# Altium schematic sheet DXP格式 单片机交通灯.SchDoc
size A3
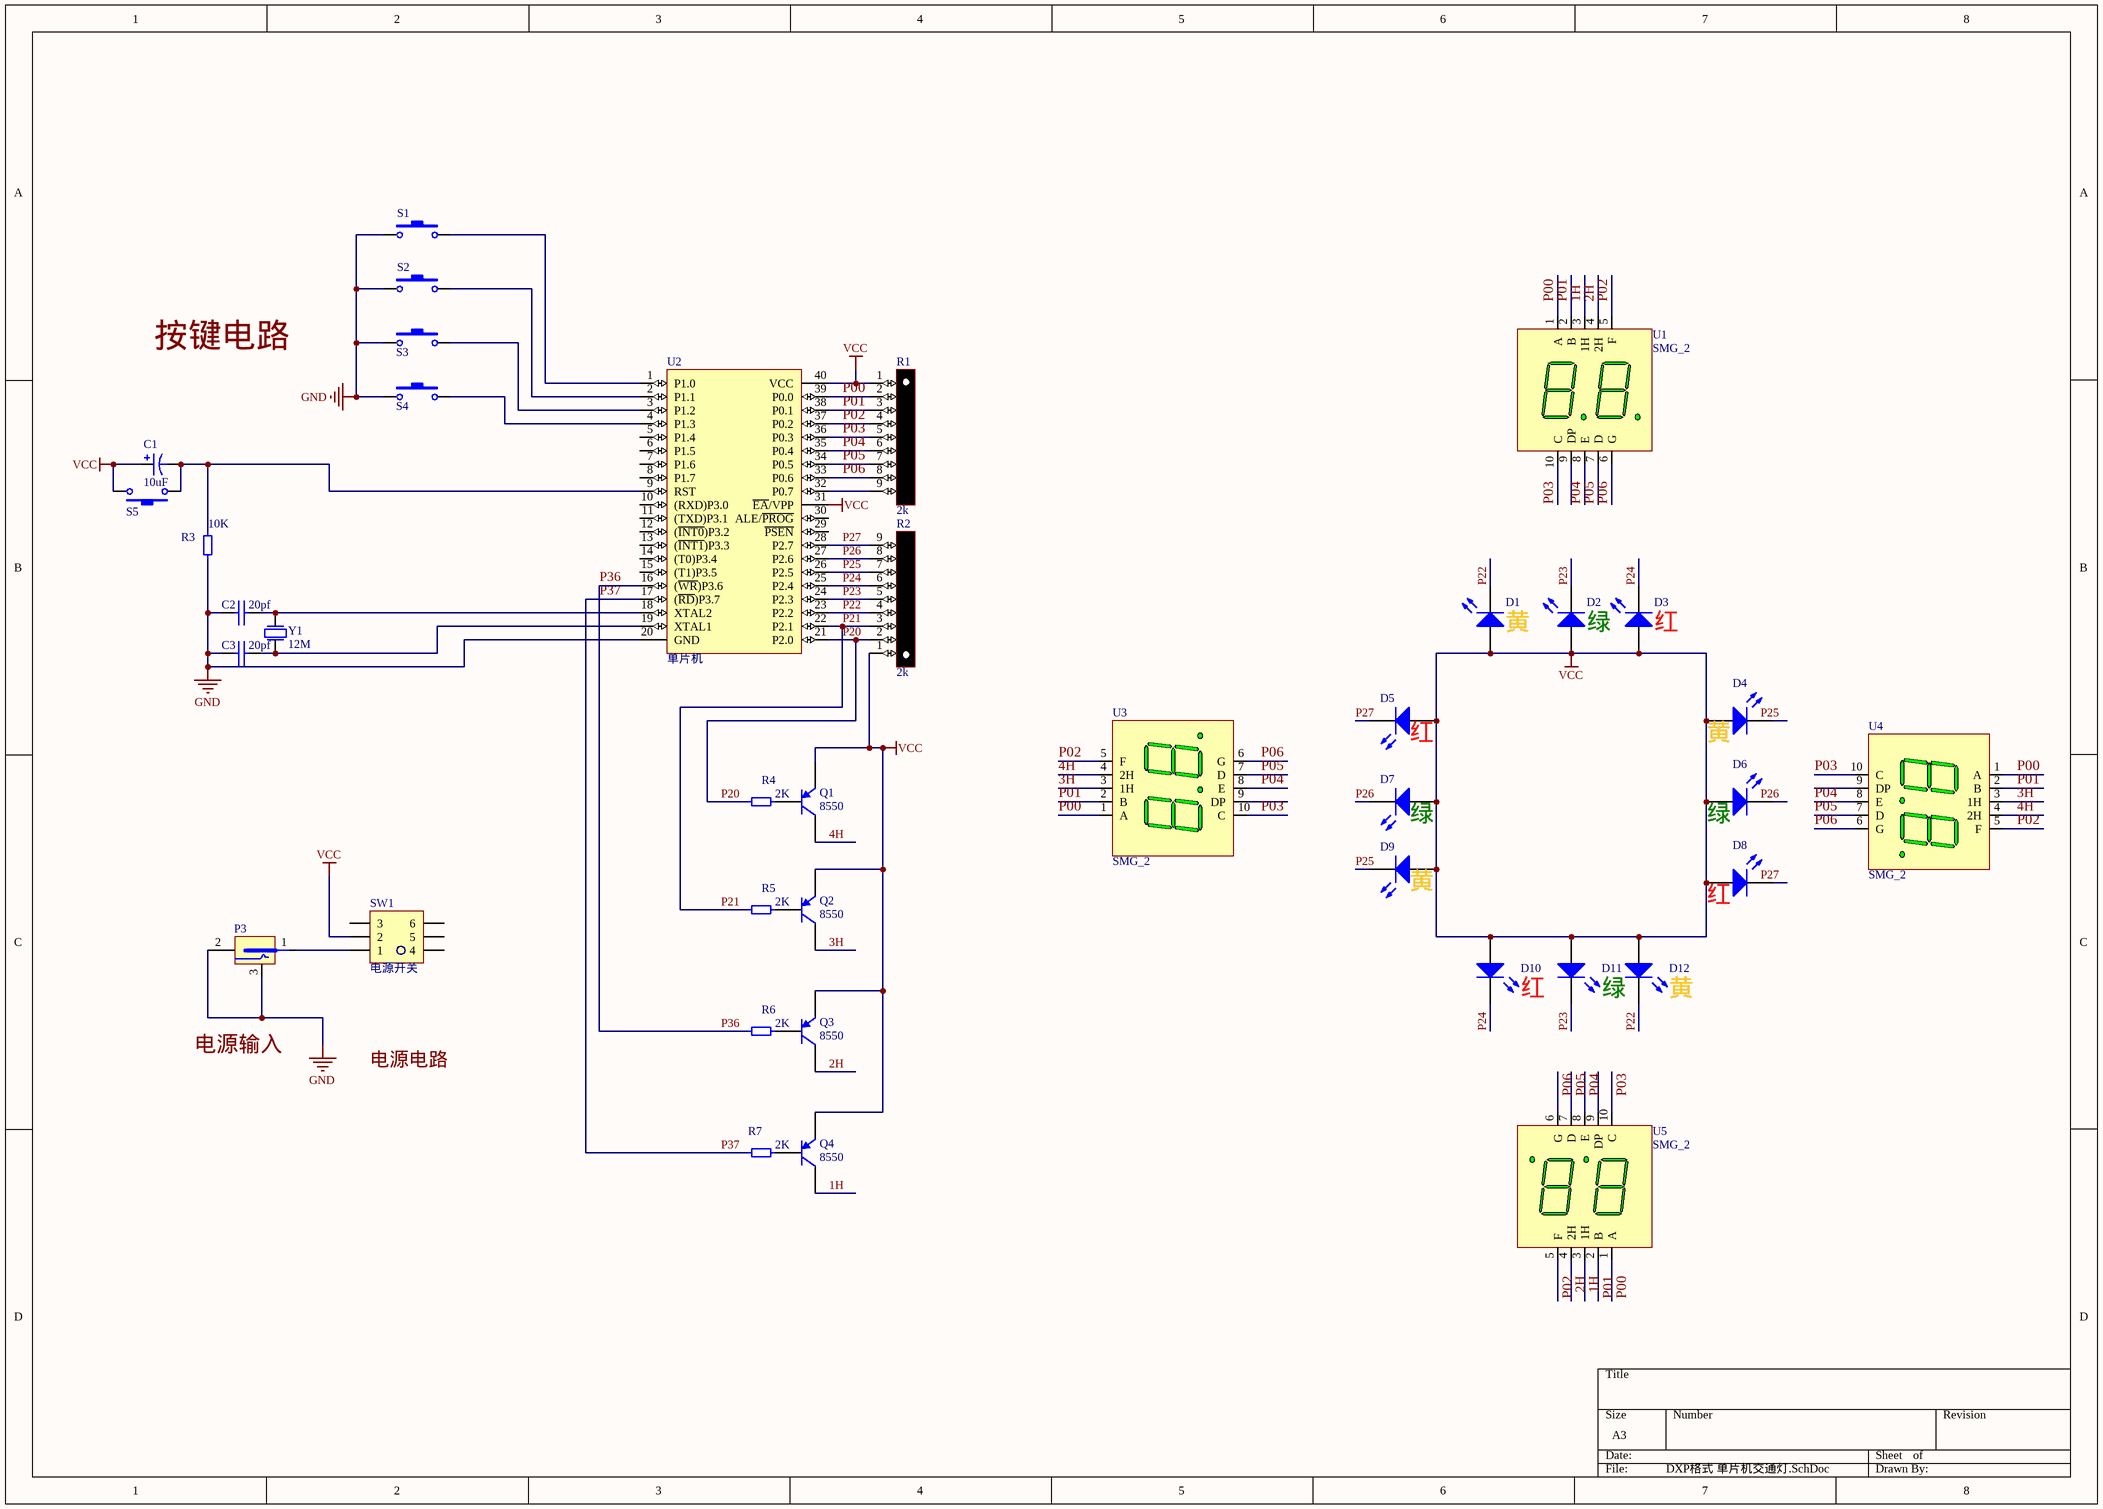
[diagram p0: DXP格式 单片机交通灯.SchDoc]

## Parts
C1  10uF  [C_10]
C2  20pf  [CAP CP]
C3  20pf  [CAP CP]
D1  黄  [LED2J]
D2  绿  [LED2J]
D3  红  [LED2J]
D4  黄  [LED2J]
D5  红  [LED2J]
D6  绿  [LED2J]
D7  绿  [LED2J]
D8  红  [LED2J]
D9  黄  [LED2J]
D10  红  [LED2J]
D11  绿  [LED2J]
D12  黄  [LED2J]
P3  电源输入  [DC2.1]  (value not drawn)
Q1  8550  [s三极管直插]
Q2  8550  [s三极管直插]
Q3  8550  [s三极管直插]
Q4  8550  [s三极管直插]
R1  2k  [SIP9]
R2  2k  [SIP9]
R3  10K  [AXIAL0.3]
R4  2K  [AXIAL0.3]
R5  2K  [AXIAL0.3]
R6  2K  [AXIAL0.3]
R7  2K  [AXIAL0.3]
S1  SW-PB  [key]  (value not drawn)
S2  SW-PB  [key]  (value not drawn)
S3  SW-PB  [key]  (value not drawn)
S4  SW-PB  [key]  (value not drawn)
S5  SW-PB  [key]  (value not drawn)
SW1  电源开关  [sw_自锁 1]
U1  SMG_2  [SMG_2]
U2  单片机  [DIP40 - 做板]
U3  SMG_2  [SMG_2]
U4  SMG_2  [SMG_2]
U5  SMG_2  [SMG_2]
Y1  12M  [XTAL]

## Nets
GND: C2.1 C3.1 P3.2 P3.3 R3.1 S1.2 S2.2 S3.2 S4.2 U2.20(GND)
VCC: C1.1 D1.1(A) D2.1(A) D3.1(A) D4.1(A) D5.1(A) D6.1(A) D7.1(A) D8.1(A) D9.1(A) D10.1(A) D11.1(A) D12.1(A) Q1.1(E) Q2.1(E) Q3.1(E) Q4.1(E) R1.1(COM) R2.1(COM) S5.2 SW1.2 U2.31(~{EA}/VPP) U2.40(VCC)
1H: Q4.3(C) U1.3(1H) U5.3(1H)
2H: Q3.3(C) U1.4(2H) U5.4(2H)
3H: Q2.3(C) U3.3(1H) U4.3(1H)
4H: Q1.3(C) U3.4(2H) U4.4(2H)
P00: R1.2 U1.1(A) U2.39(P0.0) U3.1(A) U4.1(A) U5.1(A)
P01: R1.3 U1.2(B) U2.38(P0.1) U3.2(B) U4.2(B) U5.2(B)
P02: R1.4 U1.5(F) U2.37(P0.2) U3.5(F) U4.5(F) U5.5(F)
P03: R1.5 U1.10(C) U2.36(P0.3) U3.10(C) U4.10(C) U5.10(C)
P04: R1.6 U1.8(E) U2.35(P0.4) U3.8(E) U4.8(E) U5.8(E)
P05: R1.7 U1.7(D) U2.34(P0.5) U3.7(D) U4.7(D) U5.7(D)
P06: R1.8 U1.6(G) U2.33(P0.6) U3.6(G) U4.6(G) U5.6(G)
P20: R2.2 R2.3 R4.2 R5.2 U2.21(P2.0) U2.22(P2.1)  [also labelled P21]
P22: D1.2(K) D12.2(K) R2.4 U2.23(P2.2)
P23: D2.2(K) D11.2(K) R2.5 U2.24(P2.3)
P24: D3.2(K) D10.2(K) R2.6 U2.25(P2.4)
P25: D9.2(K) R2.7 U2.26(P2.5)
P26: D7.2(K) R2.8 U2.27(P2.6)
P27: D5.2(K) R2.9 U2.28(P2.7)
P36: R6.2 R7.2 U2.16((~{WR})P3.6) U2.17((~{RD})P3.7)  [also labelled P37]
NetC1_2: C1.2 R3.2 S5.1 U2.9(RST)
NetC2_2: C2.2 U2.18(XTAL2) Y1.1(P1)
NetC3_2: C3.2 U2.19(XTAL1) Y1.2(P2)
NetP3_1: P3.1 SW1.1
NetQ1_2: Q1.2(B) R4.1
NetQ2_2: Q2.2(B) R5.1
NetQ3_2: Q3.2(B) R6.1
NetQ4_2: Q4.2(B) R7.1
NetR1_9: R1.9 U2.32(P0.7)
NetS1_1: S1.1 U2.1(P1.0)
NetS2_1: S2.1 U2.2(P1.1)
NetS3_1: S3.1 U2.3(P1.2)
NetS4_1: S4.1 U2.4(P1.3)

Not connected (* = marked no-connect by the designer): D4 2(K); D6 2(K); D8 2(K); SW1 3 4 5 6; U1 9(DP); U2 5(P1.4) 6(P1.5) 7(P1.6) 8(P1.7) 10((RXD)P3.0) 11((TXD)P3.1) 12((~{INT0})P3.2) 13((~{INT1})P3.3) 14((T0)P3.4) 15((T1)P3.5) 29(~{PSEN}) 30(ALE/~{PROG}); U3 9(DP); U4 9(DP); U5 9(DP)

## Notes on the sheet
- Labels drawn without touching a wire or pin: P25, P26, P27, 按键电路, 电源电路, 电源输入

## Library data of the parts
C1 = Cap Pol1: Polarized Capacitor (Radial); Published: 8-Jun-2000; LatestRevisionDate: 17-Jul-2002; LatestRevisionNote: Re-released for DXP Platform.; PackageReference: RB7.6-15; Publisher: Altium Limited
C2 C3 = CAP: 电容
D1-D12 = LED: 发光二极管
P3 = POWER
Q1-Q4 = 2N3906: PNP General Purpose Amplifier; Published: 8-Jun-2000; LatestRevisionDate: 15-Jan-2003; LatestRevisionNote: PCB Footprint 'BCY-W3/D4.7' replaced; DatasheetVersion: 1997; PackageVersion: Sep-1998; PackageReference: TO-92A; Publisher: Altium Limited; Code_JEDEC: TO-92A; ComponentLink1Description: Manufacturer Link; ComponentLink1URL: http://www.fairchildsemi.com/; ComponentLink2Description: Datasheet; ComponentLink2URL: http://www.fairchildsemi.com/ds/2N%2F2N3906.pdf
R1 R2 = RES9: 排阻
R3-R7 = RES2
S1-S5 = SW-PB: Switch; Published: 24-Mar-1999; LatestRevisionDate: 17-Jul-2002; LatestRevisionNote: Re-released for DXP Platform.; PackageReference: SPST-2; Publisher: Altium Limited
SW1 = SW1
U2 = U1
Y1 = 16M: Crystal Oscillator